# EasyEDA schematic SCH_Urinometer.json
TITLE: Sheet_1; REV: 1.0; Date: 2025-03-13; Sheet: 1/1; Drawn By: ashwinp; Company: Your Company
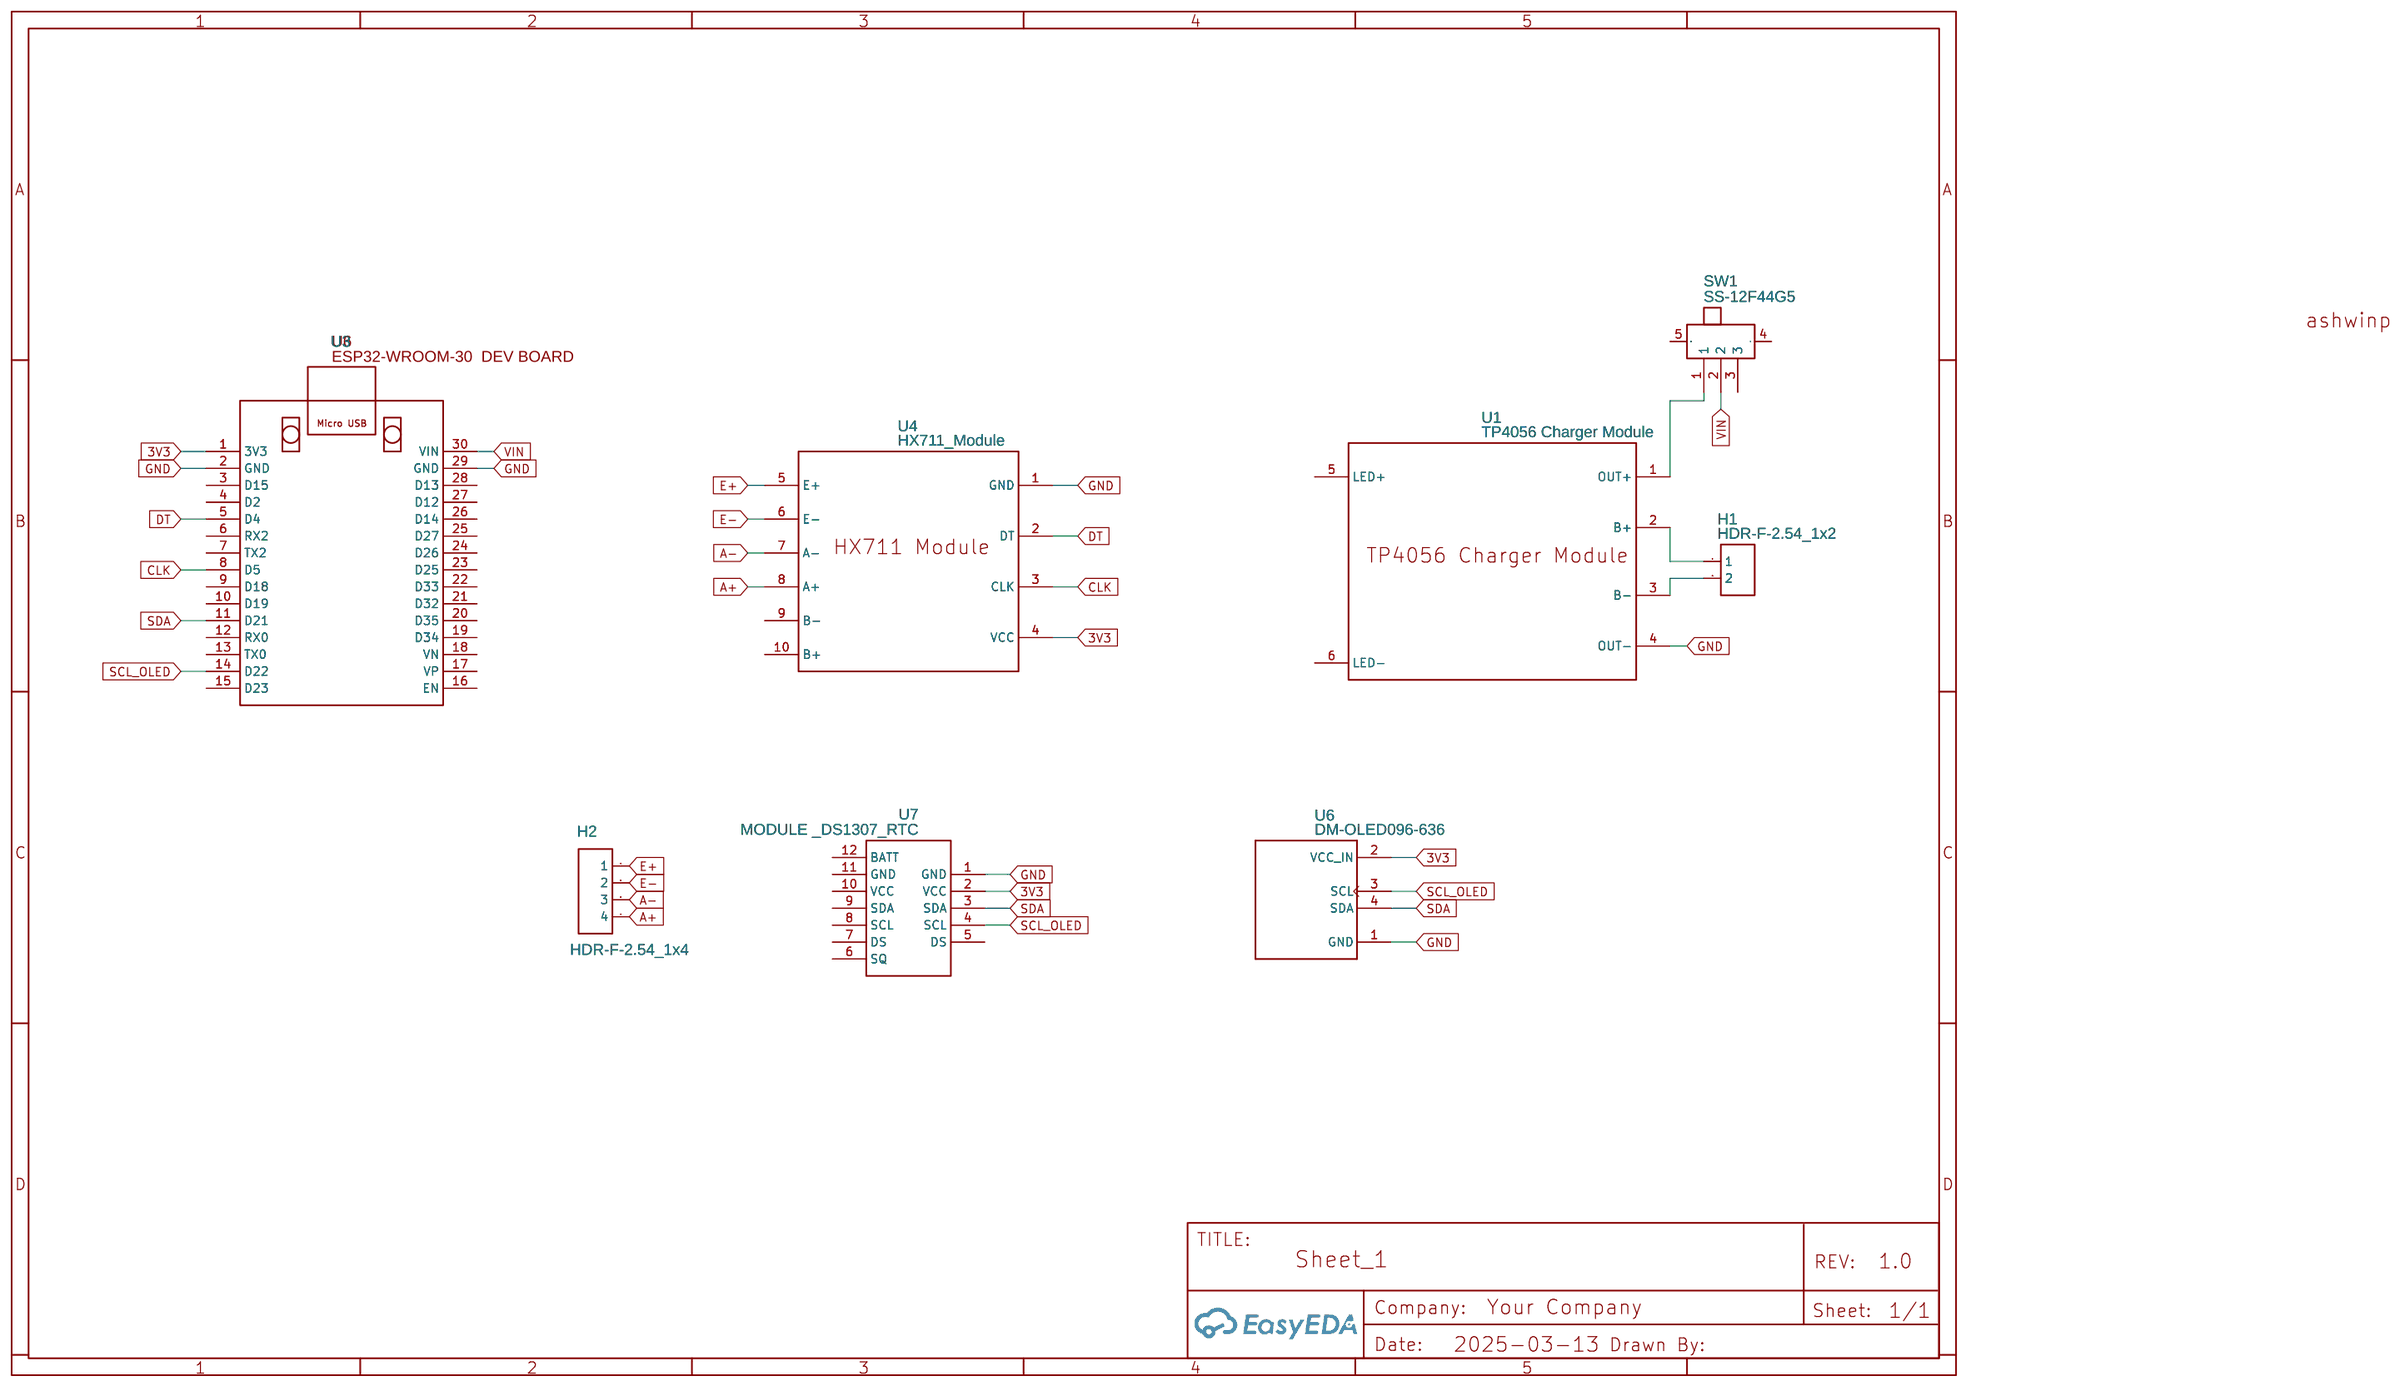
[diagram p0: schematic sheet]

## Parts
H1  HDR-F-2.54_1x2  [HDR-F-2.54_1X2]
H2  HDR-F-2.54_1x4  [HDR-F-2.54_1X4]
SW1  SS-12F44G5  [SW-TH_SS-12F44G5]
U1  TP4056 Charger Module  [TP4056 CHARGER MODULE]
U3  ESP32-WROOM 30-pin dev board for urinometer v2  [ESP32-WROOM-30-DEVBOARD]
U4  HX711_Module  [HX711_MODULE]
U6  DM-OLED096-636  [MODULE_DM-OLED096-636]
U7  MODULE _DS1307_RTC  [MODULE_DS1307_RTC]

## Library data of the parts
H1 = HDR-F-2.54_1x2: Supplier Part: C49661; Supplier: LCSC; Contributor: LCEDA_Lib
H2 = HDR-F-2.54_1x4: Supplier Part: C225501; Supplier: LCSC; Contributor: LCEDA_Lib
SW1 = SS-12F44G5: Supplier: LCSC; Supplier Part: C22355757; Manufacturer: SOFNG(硕方); Contributor: lcsc
U1 = TP4056 Charger Module: Contributor: ashwinp
U3 = ESP32-WROOM 30-pin dev board for urinometer v2: Contributor: ashwinp
U4 = HX711_Module: Contributor: ashwinp
U6 = DM-OLED096-636: Contributor: jamesreg373
U7 = MODULE _DS1307_RTC: Supplier: Naba Tech World; Contributor: lydeek; text: tewt

## Nets
3V3: U3.1(3V3) U4.4(VCC) U6.2(VCC_IN) U7.2(VCC)
GND: U1.4(OUT-) U3.2(GND) U3.29(GND) U4.1(GND) U6.1(GND) U7.1(GND)
VIN: SW1.2 U3.30(VIN)
A+: H2.4 U4.8(A+)
A-: H2.3 U4.7(A-)
CLK: U3.8(D5) U4.3(CLK)
DT: U3.5(D4) U4.2(DT)
E+: H2.1 U4.5(E+)
E-: H2.2 U4.6(E-)
SCL_OLED: U3.14(D22) U6.3(SCL) U7.4(SCL)
SDA: U3.11(D21) U6.4(SDA) U7.3(SDA)
Net-(H1-1): H1.1 U1.2(B+)
Net-(H1-2): H1.2 U1.3(B-)
Net-(SW1-1): SW1.1 U1.1(OUT+)

Not connected (* = marked no-connect by the designer): SW1 3 4 5; U1 5(LED+) 6(LED-); U3 3(D15) 4(D2) 6(RX2) 7(TX2) 9(D18) 10(D19) 12(RX0) 13(TX0) 15(D23) 16(EN) 17(VP) 18(VN) 19(D34) 20(D35) 21(D32) 22(D33) 23(D25) 24(D26) 25(D27) 26(D14) 27(D12) 28(D13); U4 9(B-) 10(B+); U7 5(DS) 6(SQ) 7(DS) 8(SCL) 9(SDA) 10(VCC) 11(GND) 12(BATT)
